# Altium schematic sheet 09-multimodal-microcontroller-switches-display.SchDoc
size A; SheetNumber: 10; SheetTotal: 14
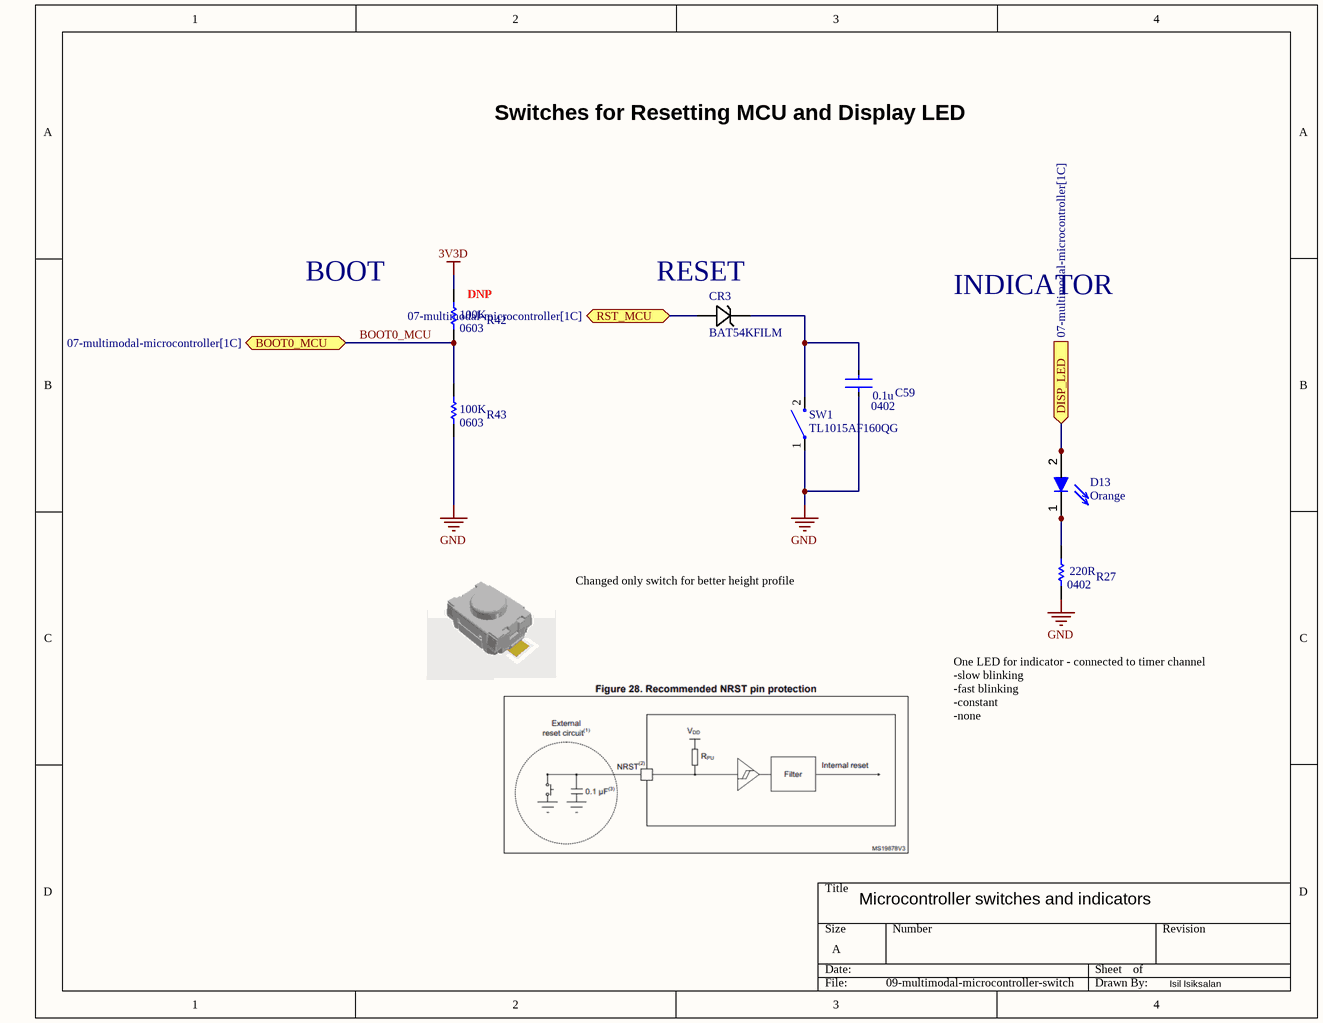
[diagram p0: 09-multimodal-microcontroller-switches-display.SchDoc]

## Parts
C59  C1005X7R1H104K050BB  [CAPTDK0402]  (value not drawn)
CR3  BAT54KFILM  [SOD-523_STM-L]
D13  Orange  [DISPLAY-LED]
R27  RMCF0402JT220R  [RES-STACK-POLE-0402]  (value not drawn)
R42  RMCF0603JG100K  [RES-STACK-POLE-0603]  (value not drawn)  (no BOM)
R43  RMCF0603JG100K  [RES-STACK-POLE-0603]  (value not drawn)
SW1  TL1015AF160QG  [TACTILE-SWITCH]

## Ports
BOOT0_MCU (bidir, see 07-multimodal-microcontroller[1C]), DISP_LED (in, see 07-multimodal-microcontroller[1C]), RST_MCU (bidir, see 07-multimodal-microcontroller[1C])

## Nets
3V3D: R42.2
GND: C59.2 R27.1 R43.1 SW1.1
BOOT0_MCU: R42.1 R43.2 ; port BOOT0_MCU
DISP_LED: D13.2 ; port DISP_LED
RST_MCU: CR3.2 ; port RST_MCU
NetC59_1: C59.1 CR3.1 SW1.2
NetD13_1: D13.1 R27.2

## Notes on the sheet
- Switches for Resetting MCU and Display LED
- BOOT
- (near R42) DNP
- (near CR3) RESET
- INDICATOR
- Changed only switch for better height profile
- One LED for indicator - connected to timer channel
  -slow blinking
  -fast blinking
  -constant
  -none
- Microcontroller switches and indicators
- Isil Isiksalan
- (in symbol C1005X7R1H104K050BB) 0.1u; 0402
- (in symbol RMCF0402JT220R) 220R; 0402
- (in symbol RMCF0603JG100K) 100K; 0603

## Library data of the parts
C59 = C1005X7R1H104K050BB: CAP CER 0.1UF 50V X7R 0402; Supplier 1: Digi-Key; Supplier Part Number 1: 445-5932-1-ND
CR3 = BAT54KFILM: 40 V, 300 mA General purpose  Signal Schottky Diode; Manufacturer_Name: STMicroelectronics; Copyright: Copyright (C) 2025 Ultra Librarian. All rights reserved.; Manufacturer_Part_Number: BAT54KFILM; Refdes: Refdes
D13 = LTST-C191KFKT: LED ORANGE CLEAR 0603 SMD; Supplier 1: Digi-Key; Supplier Part Number 1: 160-1445-1-ND
R27 = RMCF0402JT220R: RES 220 OHM 5% 1/16W 0402; Supplier 1: Digi-Key; Supplier Part Number 1: RMCF0402JT220RCT-ND
R42 R43 = RMCF0603JG100K: RES 100K OHM 5% 1/10W 0603; Supplier 1: DigiKey; Supplier Part Number 1: RMCF0603JG100KCT-ND
SW1 = TL1015AF160QG: SWITCH TACTILE SPST-NO 0.05A 12V; Supplier 1: Digi-Key; Supplier Part Number 1: EG4344CT-ND